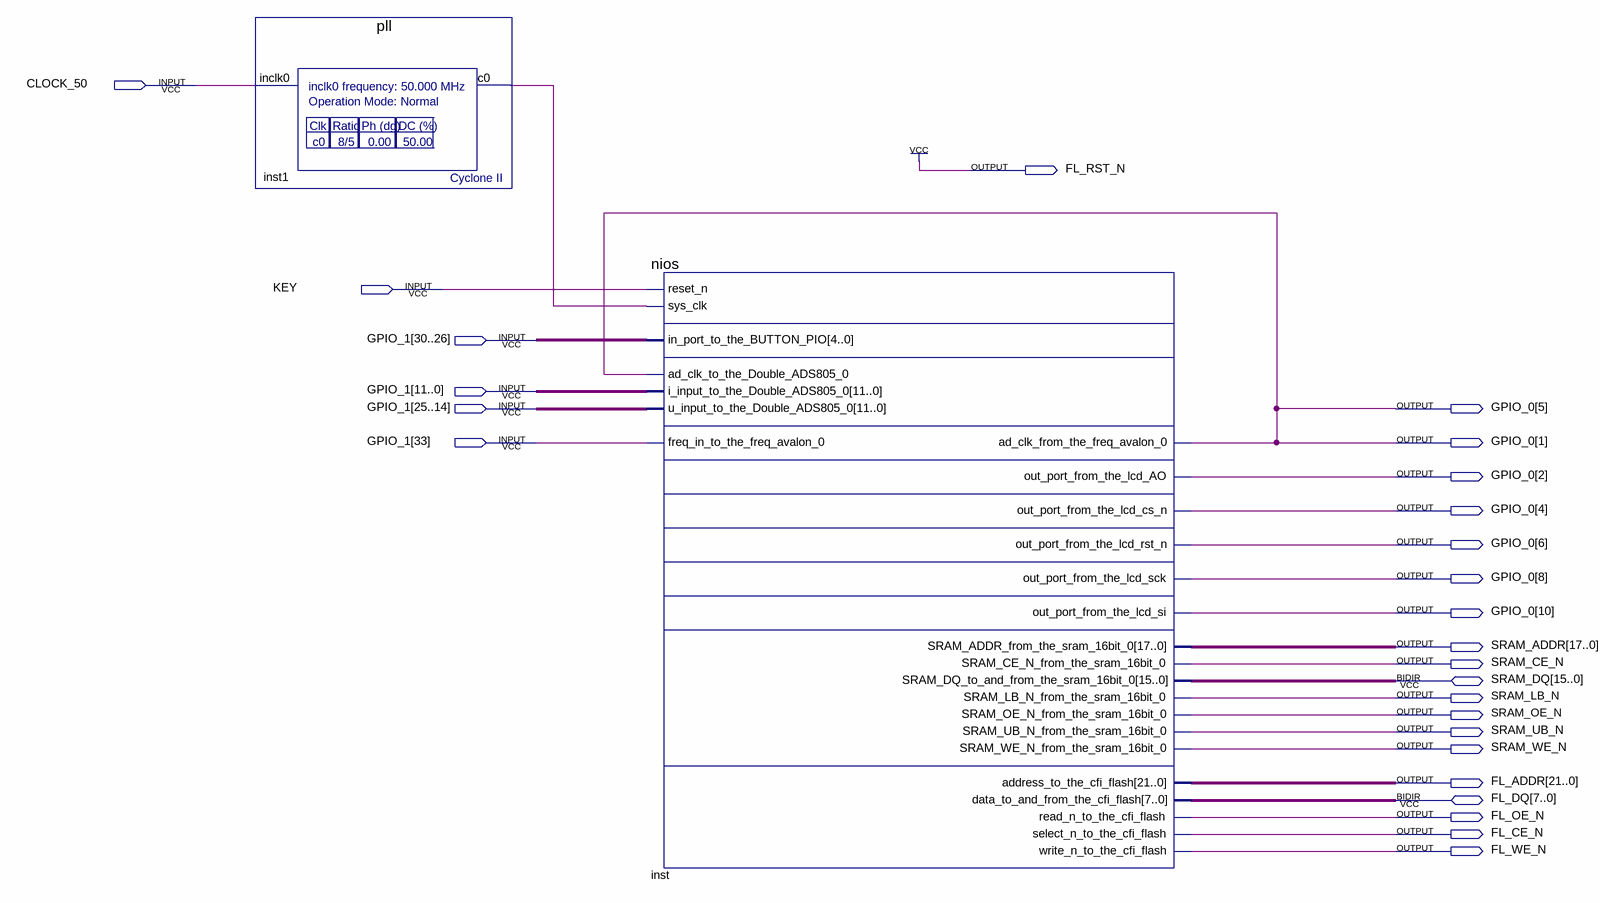
[diagram p0: schematic sheet]
// Quartus schematic sun_vc.bdf as structural Verilog: 2 symbols, 26 pins
module sun_vc (
  input  CLOCK_50,
  input  KEY,
  input  [33:0] GPIO_1,
  inout  [15:0] SRAM_DQ,
  inout  [7:0] FL_DQ,
  output FL_RST_N,
  output [10:1] GPIO_0,
  output [17:0] SRAM_ADDR,
  output SRAM_CE_N,
  output SRAM_LB_N,
  output SRAM_OE_N,
  output SRAM_UB_N,
  output SRAM_WE_N,
  output [21:0] FL_ADDR,
  output FL_OE_N,
  output FL_CE_N,
  output FL_WE_N
);

  wire inst1_c0;

  pll inst1 (.inclk0(CLOCK_50), .c0(inst1_c0));
  nios inst (
    .reset_n(KEY), .sys_clk(inst1_c0), .in_port_to_the_BUTTON_PIO(GPIO_1[30:26]),
    .ad_clk_to_the_Double_ADS805_0(GPIO_0[5]), .i_input_to_the_Double_ADS805_0(GPIO_1[11:0]),
    .u_input_to_the_Double_ADS805_0(GPIO_1[25:14]), .freq_in_to_the_freq_avalon_0(GPIO_1[33]),
    .ad_clk_from_the_freq_avalon_0(GPIO_0[5]), .out_port_from_the_lcd_AO(GPIO_0[2]),
    .out_port_from_the_lcd_cs_n(GPIO_0[4]), .out_port_from_the_lcd_rst_n(GPIO_0[6]),
    .out_port_from_the_lcd_sck(GPIO_0[8]), .out_port_from_the_lcd_si(GPIO_0[10]),
    .SRAM_ADDR_from_the_sram_16bit_0(SRAM_ADDR), .SRAM_CE_N_from_the_sram_16bit_0(SRAM_CE_N),
    .SRAM_LB_N_from_the_sram_16bit_0(SRAM_LB_N), .SRAM_OE_N_from_the_sram_16bit_0(SRAM_OE_N),
    .SRAM_UB_N_from_the_sram_16bit_0(SRAM_UB_N), .SRAM_WE_N_from_the_sram_16bit_0(SRAM_WE_N),
    .address_to_the_cfi_flash(FL_ADDR), .read_n_to_the_cfi_flash(FL_OE_N),
    .select_n_to_the_cfi_flash(FL_CE_N), .write_n_to_the_cfi_flash(FL_WE_N),
    .SRAM_DQ_to_and_from_the_sram_16bit_0(SRAM_DQ), .data_to_and_from_the_cfi_flash(FL_DQ));

  assign FL_RST_N = 1'b1;
  assign GPIO_0[1] = GPIO_0[5];
endmodule
